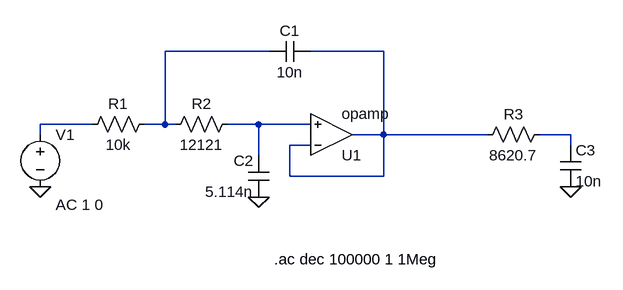
[diagram p0: schematic Bonus2.asc]
Bonus2.asc, the LTspice schematic file:
Version 4.1
SHEET 1 880 680
WIRE 96 48 -64 48
WIRE 272 48 160 48
WIRE -176 160 -256 160
WIRE -64 160 -64 48
WIRE -64 160 -96 160
WIRE -48 160 -64 160
WIRE 80 160 32 160
WIRE 160 160 80 160
WIRE -256 176 -256 160
WIRE 272 176 272 48
WIRE 272 176 224 176
WIRE 432 176 272 176
WIRE 560 176 512 176
WIRE 160 192 128 192
WIRE 560 192 560 176
WIRE 80 208 80 160
WIRE 128 240 128 192
WIRE 272 240 272 176
WIRE 272 240 128 240
FLAG 80 272 0
FLAG -256 256 0
FLAG 560 256 0
SYMBOL opamp 192 240 M180
SYMATTR InstName U1
SYMBOL cap 160 32 R90
WINDOW 0 0 32 VBottom 2
WINDOW 3 32 32 VTop 2
SYMATTR InstName C1
SYMATTR Value 10n
SYMBOL cap 96 272 R180
WINDOW 0 24 56 Left 2
WINDOW 3 24 8 Left 2
SYMATTR InstName C2
SYMATTR Value 5.114n
SYMBOL res -80 144 R90
WINDOW 0 0 56 VBottom 2
WINDOW 3 32 56 VTop 2
SYMATTR InstName R1
SYMATTR Value 10k
SYMBOL res 48 144 R90
WINDOW 0 0 56 VBottom 2
WINDOW 3 32 56 VTop 2
SYMATTR InstName R2
SYMATTR Value 12121
SYMBOL voltage -256 160 R0
WINDOW 123 24 124 Left 2
WINDOW 39 0 0 Left 0
SYMATTR InstName V1
SYMATTR Value ""
SYMATTR Value2 AC 1 0
SYMBOL res 528 160 R90
WINDOW 0 0 56 VBottom 2
WINDOW 3 32 56 VTop 2
SYMATTR InstName R3
SYMATTR Value 8620.7
SYMBOL cap 544 192 R0
SYMATTR InstName C3
SYMATTR Value 10n
TEXT 104 368 Left 2 !.ac dec 100000 1 1Meg

The netlist it stands for:
* Bonus2.asc
X§U1 N002 N004 N002 opamp Aol=100K GBW=10Meg  ; pins invin noninvin out
C1 N002 N001 10n
C2 0 N004 5.114n
R1 N001 N003 10k
R2 N004 N001 12121
V1 N003 0 AC 1 0
R3 N005 N002 8620.7
C3 N005 0 10n
.ac dec 100000 1 1Meg
.backanno
.end